# Altium schematic sheet Power_Switch.SchDoc
size A
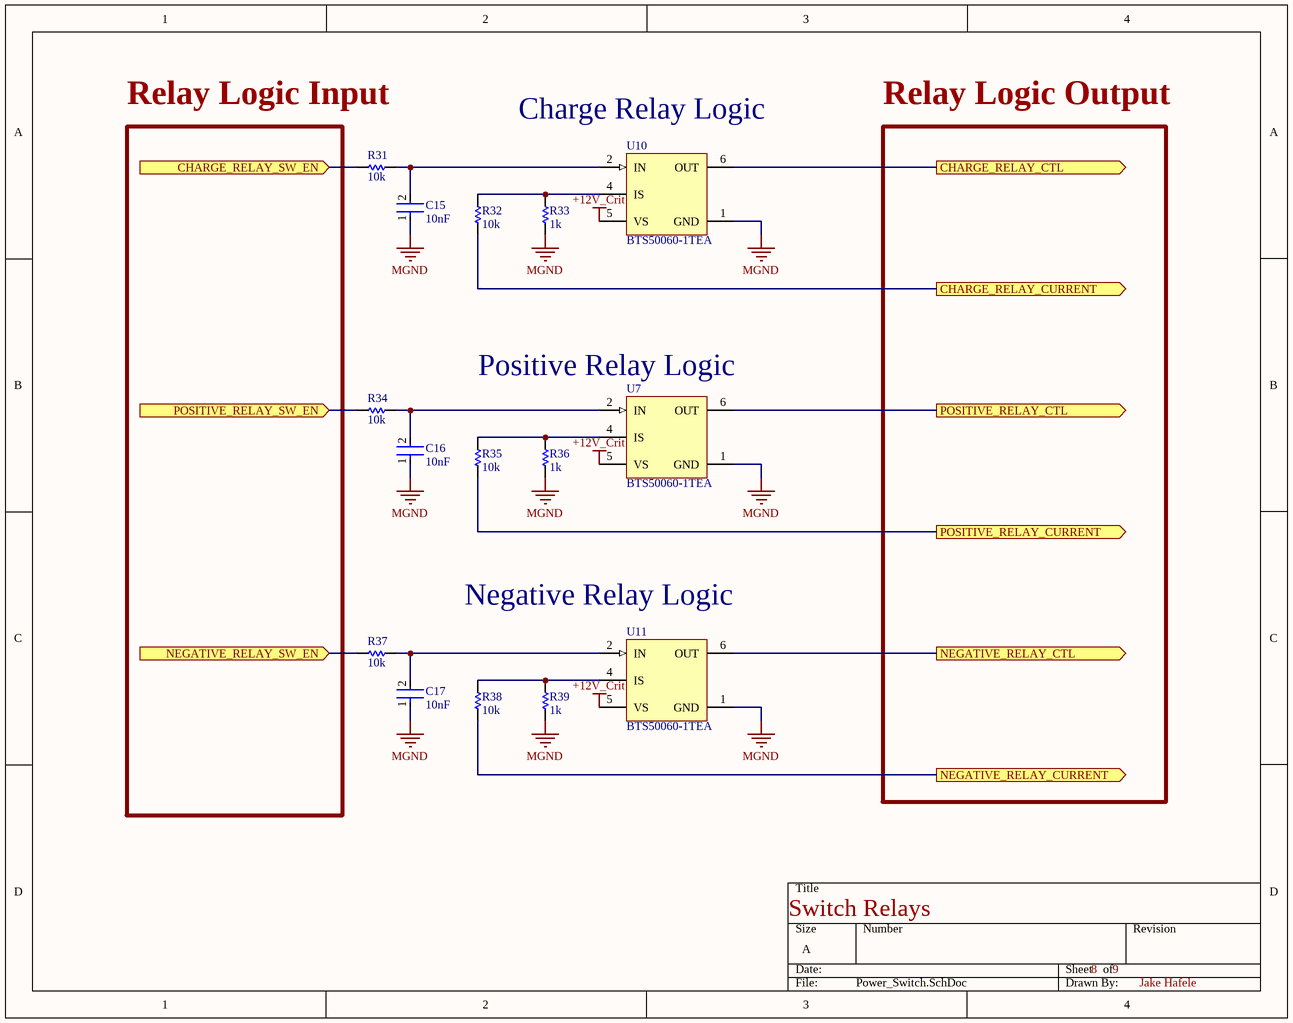
[diagram p0: Power_Switch.SchDoc]

## Parts
C15  Capacitance: 10nF  [FP-CGA3E-0_3-0_1-IPC_A]  (hidden comment: CGA3E2X8R2A103K080AD)
C16  Capacitance: 10nF  [FP-CGA3E-0_3-0_1-IPC_A]  (hidden comment: CGA3E2X8R2A103K080AD)
C17  Capacitance: 10nF  [FP-CGA3E-0_3-0_1-IPC_A]  (hidden comment: CGA3E2X8R2A103K080AD)
R31  SchematicInformation: 10k  [R_0603]  (hidden comment: RES_10k_1%_0603)
R32  SchematicInformation: 10k  [R_0603]  (hidden comment: RES_10k_1%_0603)
R33  SchematicInformation: 1k  [R_0603]  (hidden comment: RES_1k_1%_0603)
R34  SchematicInformation: 10k  [R_0603]  (hidden comment: RES_10k_1%_0603)
R35  SchematicInformation: 10k  [R_0603]  (hidden comment: RES_10k_1%_0603)
R36  SchematicInformation: 1k  [R_0603]  (hidden comment: RES_1k_1%_0603)
R37  SchematicInformation: 10k  [R_0603]  (hidden comment: RES_10k_1%_0603)
R38  SchematicInformation: 10k  [R_0603]  (hidden comment: RES_10k_1%_0603)
R39  SchematicInformation: 1k  [R_0603]  (hidden comment: RES_1k_1%_0603)
U7  BTS50060-1TEA  [INF-PG-TO252-5_BTF50060_L]
U10  BTS50060-1TEA  [INF-PG-TO252-5_BTF50060_L]
U11  BTS50060-1TEA  [INF-PG-TO252-5_BTF50060_L]

## Ports
CHARGE_RELAY_CTL (out), CHARGE_RELAY_CURRENT (out), CHARGE_RELAY_SW_EN (in), NEGATIVE_RELAY_CTL (out), NEGATIVE_RELAY_CURRENT (out), NEGATIVE_RELAY_SW_EN (in), POSITIVE_RELAY_CTL (out), POSITIVE_RELAY_CURRENT (out), POSITIVE_RELAY_SW_EN (in)

## Nets
+12V_Crit: U7.5(VS) U10.5(VS) U11.5(VS)
MGND: C15.1 C16.1 C17.1 R33.1 R36.1 R39.1 U7.1(GND) U10.1(GND) U11.1(GND)
CHARGE_RELAY_CTL: U10.6(OUT) ; port CHARGE_RELAY_CTL
CHARGE_RELAY_CURRENT: R32.1 ; port CHARGE_RELAY_CURRENT
CHARGE_RELAY_SW_EN: R31.1 ; port CHARGE_RELAY_SW_EN
NEGATIVE_RELAY_CTL: U11.6(OUT) ; port NEGATIVE_RELAY_CTL
NEGATIVE_RELAY_CURRENT: R38.1 ; port NEGATIVE_RELAY_CURRENT
NEGATIVE_RELAY_SW_EN: R37.1 ; port NEGATIVE_RELAY_SW_EN
POSITIVE_RELAY_CTL: U7.6(OUT) ; port POSITIVE_RELAY_CTL
POSITIVE_RELAY_CURRENT: R35.1 ; port POSITIVE_RELAY_CURRENT
POSITIVE_RELAY_SW_EN: R34.1 ; port POSITIVE_RELAY_SW_EN
NetC15_2: C15.2 R31.2 U10.2(IN)
NetC16_2: C16.2 R34.2 U7.2(IN)
NetC17_2: C17.2 R37.2 U11.2(IN)
NetR32_2: R32.2 R33.2 U10.4(IS)
NetR35_2: R35.2 R36.2 U7.4(IS)
NetR38_2: R38.2 R39.2 U11.4(IS)

## Notes on the sheet
- Relay Logic Input
- (near U10) Charge Relay Logic
- Relay Logic Output
- (near U7) Positive Relay Logic
- (near U11) Negative Relay Logic
- Switch Relays
- 8
- 9
- Jake Hafele

## Library data of the parts
C15-C17 = CMP-08246-000769-1: Cap Ceramic 10nF 100V X8R 10% Pad SMD 0603 +150°C Automotive T/R; Mount: Surface Mount; Voltage Rating (DC): 100V; Termination: SMD/SMT; Dielectric: X8R; Case/Package: 0603; Ratings: AEC-Q200; Voltage Rating: 100V; Packaging: Tape and Reel; Thickness: 0.035inch; Composition: Ceramic; Max Operating Temperature: 150°C; Width: 0.031inch; Height: 0.8mm; Weight: 7.1E-05oz; Depth: 0.8mm; Min Operating Temperature: -55°C; Length: 1.6mm; Case Code (Metric): 1608; Tolerance: 10%; Package Quantity: 4000; Case Code (Imperial): 0603
R31 R32 R34 R35 R37 R38 = RES_10k_1%_0603: Manufacturer Part Number: RC0603FR-0710KL; Manufacturer: Yageo; DigiKey Part Number: 311-10.0KHRCT-ND
R33 R36 R39 = RES_1k_1%_0603: Manufacturer Part Number: RC0603FR-071KL; Manufacturer: Yageo; DigiKey Part Number: 311-1.00KHRCT-ND
U7 U10 U11 = CMP-1095-00101-1: High Current PROFET Smart High-Side Power Switch, 1 Channel, 16.5 A Load Current, -40 to 150 degC, PG-TO252-5-11, Reel, Green; Manufacturer: Infineon; ton (max): 130 us; Channels: 1; Recommended Operating Voltage Max.: 28 V; toff (max): 150 us; RON @ 25degreesC: 6 mOhm; Recommended Operating Voltage Min.: 4.7 V; Green: TRUE; RON(max) @ 150degreesC: 12 mOhm; Load Current (typ): 16.5 A; Group: Automotive Qualified; PackageDescription: 5-Pin Plastic (Green) Transistor Single Outline Package, 6.5 x 6.12 mm Body, 1.14 mm Pitch; PackageVersion: Sep-11; ComponentLink2Description: Datasheet; Mounting Technology: Surface Mount; ComponentLink2URL: http://www.infineon.com/dgdl/BTS50060-1TEA_DS_v12_2011-09-01.pdf?folderId=db3a304314dca389011537739e37155f&fileId=db3a30432ac1eb91012ad29559f104ad&location=en.Products.Automotive_ICs.Smart_High-_and_Low-Side_Switches.PROFET__-_Smart_High_Side_Switches.DATA; DatasheetVersion: Rev.1.2; PartNumber: BTS50060-1TEA; ComponentLink3URL: http://www.infineon.com/dgdl/BTF50060-1TEA_DS_v12_2011-09-01.pdf?folderId=db3a304314dca389011537739e37155f&fileId=db3a30432ad629a6012b0a94d88d3f2e&sId=db3a30433db6f09f013dc356c9f93bd9; Halogen-free: TRUE; PackageReference: PG-TO252-5-11; ComponentLink3Description: Package Specification; ComponentLink1Description: Manufacturer URL; ComponentLink1URL: http://www.infineon.com/; Packing: Reel